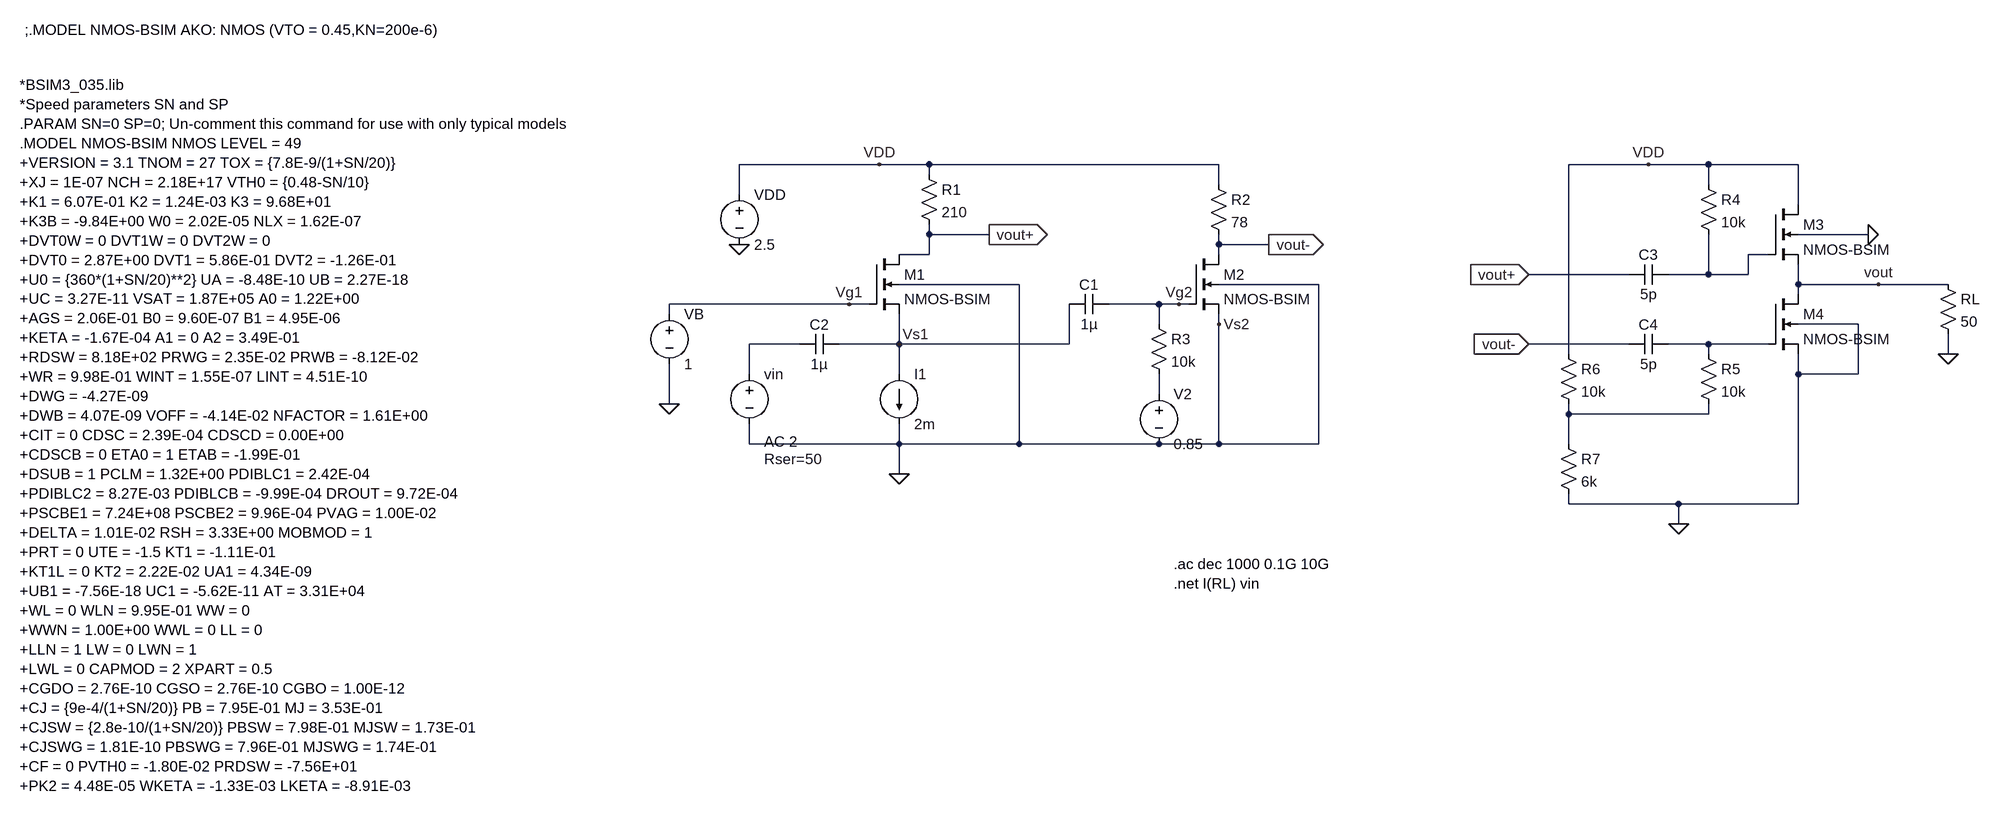
[diagram p0: schematic 3x350nm_nx.asc]
3x350nm_nx.asc, the LTspice schematic file:
Version 4
SHEET 1 2104 1272
WIRE 224 32 0 32
WIRE 304 32 224 32
WIRE 768 32 304 32
WIRE 1456 32 1328 32
WIRE 1552 32 1456 32
WIRE 1696 32 1552 32
WIRE 304 48 304 32
WIRE 768 64 768 32
WIRE 1552 64 1552 32
WIRE 0 80 0 32
WIRE 1696 96 1696 32
WIRE 304 144 304 128
WIRE 400 144 304 144
WIRE 1808 144 1696 144
WIRE 768 160 768 144
WIRE 848 160 768 160
WIRE 304 176 304 144
WIRE 304 176 256 176
WIRE 768 176 768 160
WIRE 1648 176 1616 176
WIRE 1424 208 1264 208
WIRE 1552 208 1552 144
WIRE 1552 208 1488 208
WIRE 1616 208 1616 176
WIRE 1616 208 1552 208
WIRE 448 224 256 224
WIRE 928 224 768 224
WIRE 1696 224 1696 192
WIRE 1824 224 1696 224
WIRE 1936 224 1824 224
WIRE 1696 240 1696 224
WIRE 176 256 -112 256
WIRE 208 256 176 256
WIRE 672 256 592 256
WIRE 704 256 672 256
WIRE 720 256 704 256
WIRE -112 272 -112 256
WIRE 672 288 672 256
WIRE 768 288 768 272
WIRE 1792 288 1696 288
WIRE 96 320 16 320
WIRE 256 320 256 272
WIRE 256 320 160 320
WIRE 528 320 528 256
WIRE 528 320 256 320
WIRE 1424 320 1264 320
WIRE 1552 320 1488 320
WIRE 1648 320 1552 320
WIRE 1328 336 1328 32
WIRE 1552 336 1552 320
WIRE 1936 336 1936 304
WIRE 16 368 16 320
WIRE 256 368 256 320
WIRE 1696 368 1696 336
WIRE 1792 368 1792 288
WIRE 1792 368 1696 368
WIRE 672 400 672 368
WIRE -112 416 -112 352
WIRE 1328 432 1328 416
WIRE 1552 432 1552 416
WIRE 1552 432 1328 432
WIRE 16 480 16 448
WIRE 256 480 256 448
WIRE 256 480 16 480
WIRE 448 480 448 224
WIRE 448 480 256 480
WIRE 672 480 448 480
WIRE 768 480 768 288
WIRE 768 480 672 480
WIRE 928 480 928 224
WIRE 928 480 768 480
WIRE 1328 480 1328 432
WIRE 256 528 256 480
WIRE 1328 576 1328 560
WIRE 1504 576 1328 576
WIRE 1696 576 1696 368
WIRE 1696 576 1504 576
WIRE 1504 608 1504 576
FLAG 0 160 0
FLAG 224 32 VDD
FLAG -112 416 0
FLAG 256 320 Vs1
FLAG 176 256 Vg1
FLAG 256 528 0
FLAG 400 144 vout+
IOPIN 400 144 Out
FLAG 848 160 vout-
IOPIN 848 160 Out
FLAG 704 256 Vg2
FLAG 768 288 Vs2
FLAG 1504 608 0
FLAG 1936 336 0
FLAG 1264 208 vout+
IOPIN 1264 208 In
FLAG 1264 320 vout-
IOPIN 1264 320 In
FLAG 1456 32 VDD
FLAG 1808 144 0
FLAG 1824 224 vout
SYMBOL voltage 0 64 R0
SYMATTR InstName VDD
SYMATTR Value 2.5
SYMBOL res 288 32 R0
SYMATTR InstName R1
SYMATTR Value 210
SYMBOL voltage -112 256 R0
WINDOW 123 0 0 Left 0
WINDOW 39 0 0 Left 0
SYMATTR InstName VB
SYMATTR Value 1
SYMBOL current 256 368 R0
WINDOW 123 0 0 Left 0
WINDOW 39 0 0 Left 0
SYMATTR InstName I1
SYMATTR Value 2m
SYMBOL nmos4 208 176 R0
SYMATTR InstName M1
SYMATTR Value NMOS-BSIM
SYMATTR Value2 l=1050n w=365u
SYMBOL voltage 16 352 R0
WINDOW 123 24 124 Left 2
WINDOW 39 24 152 Left 2
SYMATTR Value2 AC 2
SYMATTR SpiceLine Rser=50
SYMATTR InstName vin
SYMATTR Value ""
SYMBOL nmos4 720 176 R0
SYMATTR InstName M2
SYMATTR Value NMOS-BSIM
SYMATTR Value2 l=1050n w=1150u
SYMBOL res 752 48 R0
SYMATTR InstName R2
SYMATTR Value 78
SYMBOL cap 592 240 R90
WINDOW 0 0 32 VBottom 2
WINDOW 3 32 32 VTop 2
SYMATTR InstName C1
SYMATTR Value 1µ
SYMBOL res 656 272 R0
SYMATTR InstName R3
SYMATTR Value 10k
SYMBOL voltage 672 384 R0
WINDOW 123 0 0 Left 0
WINDOW 39 0 0 Left 0
SYMATTR InstName V2
SYMATTR Value 0.85
SYMBOL cap 160 304 R90
WINDOW 0 0 32 VBottom 2
WINDOW 3 32 32 VTop 2
SYMATTR InstName C2
SYMATTR Value 1µ
SYMBOL cap 1488 192 R90
WINDOW 0 0 32 VBottom 2
WINDOW 3 32 32 VTop 2
SYMATTR InstName C3
SYMATTR Value 5p
SYMBOL cap 1488 304 R90
WINDOW 0 0 32 VBottom 2
WINDOW 3 32 32 VTop 2
SYMATTR InstName C4
SYMATTR Value 5p
SYMBOL res 1536 48 R0
SYMATTR InstName R4
SYMATTR Value 10k
SYMBOL res 1536 320 R0
SYMATTR InstName R5
SYMATTR Value 10k
SYMBOL res 1312 320 R0
SYMATTR InstName R6
SYMATTR Value 10k
SYMBOL res 1312 464 R0
SYMATTR InstName R7
SYMATTR Value 6k
SYMBOL res 1920 208 R0
SYMATTR InstName RL
SYMATTR Value 50
SYMBOL nmos4 1648 96 R0
SYMATTR InstName M3
SYMATTR Value NMOS-BSIM
SYMATTR Value2 l=1050n w=120u
SYMBOL nmos4 1648 240 R0
SYMATTR InstName M4
SYMATTR Value NMOS-BSIM
SYMATTR Value2 l=1050n w=515u
TEXT -1152 -96 Left 2 !*BSIM3_035.lib\n*Speed parameters SN and SP\n.PARAM SN=0 SP=0; Un-comment this command for use with only typical models\n.MODEL NMOS-BSIM NMOS LEVEL = 49\n+VERSION = 3.1 TNOM = 27 TOX = {7.8E-9/(1+SN/20)}\n+XJ = 1E-07 NCH = 2.18E+17 VTH0 = {0.48-SN/10}\n+K1 = 6.07E-01 K2 = 1.24E-03 K3 = 9.68E+01\n+K3B = -9.84E+00 W0 = 2.02E-05 NLX = 1.62E-07\n+DVT0W = 0 DVT1W = 0 DVT2W = 0\n+DVT0 = 2.87E+00 DVT1 = 5.86E-01 DVT2 = -1.26E-01\n+U0 = {360*(1+SN/20)**2} UA = -8.48E-10 UB = 2.27E-18\n+UC = 3.27E-11 VSAT = 1.87E+05 A0 = 1.22E+00\n+AGS = 2.06E-01 B0 = 9.60E-07 B1 = 4.95E-06\n+KETA = -1.67E-04 A1 = 0 A2 = 3.49E-01\n+RDSW = 8.18E+02 PRWG = 2.35E-02 PRWB = -8.12E-02\n+WR = 9.98E-01 WINT = 1.55E-07 LINT = 4.51E-10\n+DWG = -4.27E-09\n+DWB = 4.07E-09 VOFF = -4.14E-02 NFACTOR = 1.61E+00\n+CIT = 0 CDSC = 2.39E-04 CDSCD = 0.00E+00\n+CDSCB = 0 ETA0 = 1 ETAB = -1.99E-01\n+DSUB = 1 PCLM = 1.32E+00 PDIBLC1 = 2.42E-04\n+PDIBLC2 = 8.27E-03 PDIBLCB = -9.99E-04 DROUT = 9.72E-04\n+PSCBE1 = 7.24E+08 PSCBE2 = 9.96E-04 PVAG = 1.00E-02\n+DELTA = 1.01E-02 RSH = 3.33E+00 MOBMOD = 1\n+PRT = 0 UTE = -1.5 KT1 = -1.11E-01\n+KT1L = 0 KT2 = 2.22E-02 UA1 = 4.34E-09\n+UB1 = -7.56E-18 UC1 = -5.62E-11 AT = 3.31E+04\n+WL = 0 WLN = 9.95E-01 WW = 0\n+WWN = 1.00E+00 WWL = 0 LL = 0\n+LLN = 1 LW = 0 LWN = 1\n+LWL = 0 CAPMOD = 2 XPART = 0.5\n+CGDO = 2.76E-10 CGSO = 2.76E-10 CGBO = 1.00E-12\n+CJ = {9e-4/(1+SN/20)} PB = 7.95E-01 MJ = 3.53E-01\n+CJSW = {2.8e-10/(1+SN/20)} PBSW = 7.98E-01 MJSW = 1.73E-01\n+CJSWG = 1.81E-10 PBSWG = 7.96E-01 MJSWG = 1.74E-01\n+CF = 0 PVTH0 = -1.80E-02 PRDSW = -7.56E+01\n+PK2 = 4.48E-05 WKETA = -1.33E-03 LKETA = -8.91E-03
TEXT -1144 -184 Left 2 !;.MODEL NMOS-BSIM AKO: NMOS (VTO = 0.45,KN=200e-6)
TEXT 696 672 Left 2 !.ac dec 1000 0.1G 10G\n.net I(RL) vin

The netlist it stands for:
* 3x350nm_nx.asc
VDD VDD 0 2.5
R1 VDD vout+ 210
VB Vg1 0 1
I1 Vs1 0 2m
M1 vout+ Vg1 Vs1 0 NMOS-BSIM l=1050n w=365u
vin N002 0 AC 2 Rser=50
M2 vout- Vg2 0 0 NMOS-BSIM l=1050n w=1150u
R2 VDD vout- 78
C1 Vg2 Vs1 1µ
R3 Vg2 N004 10k
V2 N004 0 0.85
C2 Vs1 N002 1µ
C3 N001 vout+ 5p
C4 N003 vout- 5p
R4 VDD N001 10k
R5 N003 N005 10k
R6 VDD N005 10k
R7 N005 0 6k
RL vout 0 50
M3 VDD N001 vout 0 NMOS-BSIM l=1050n w=120u
M4 vout N003 0 0 NMOS-BSIM l=1050n w=515u
.model NMOS NMOS
.model PMOS PMOS
.lib standard.mos
*BSIM3_035.lib
*Speed parameters SN and SP
.PARAM SN=0 SP=0; Un-comment this command for use with only typical models
.MODEL NMOS-BSIM NMOS LEVEL = 49
+VERSION = 3.1 TNOM = 27 TOX = {7.8E-9/(1+SN/20)}
+XJ = 1E-07 NCH = 2.18E+17 VTH0 = {0.48-SN/10}
+K1 = 6.07E-01 K2 = 1.24E-03 K3 = 9.68E+01
+K3B = -9.84E+00 W0 = 2.02E-05 NLX = 1.62E-07
+DVT0W = 0 DVT1W = 0 DVT2W = 0
+DVT0 = 2.87E+00 DVT1 = 5.86E-01 DVT2 = -1.26E-01
+U0 = {360*(1+SN/20)**2} UA = -8.48E-10 UB = 2.27E-18
+UC = 3.27E-11 VSAT = 1.87E+05 A0 = 1.22E+00
+AGS = 2.06E-01 B0 = 9.60E-07 B1 = 4.95E-06
+KETA = -1.67E-04 A1 = 0 A2 = 3.49E-01
+RDSW = 8.18E+02 PRWG = 2.35E-02 PRWB = -8.12E-02
+WR = 9.98E-01 WINT = 1.55E-07 LINT = 4.51E-10
+DWG = -4.27E-09
+DWB = 4.07E-09 VOFF = -4.14E-02 NFACTOR = 1.61E+00
+CIT = 0 CDSC = 2.39E-04 CDSCD = 0.00E+00
+CDSCB = 0 ETA0 = 1 ETAB = -1.99E-01
+DSUB = 1 PCLM = 1.32E+00 PDIBLC1 = 2.42E-04
+PDIBLC2 = 8.27E-03 PDIBLCB = -9.99E-04 DROUT = 9.72E-04
+PSCBE1 = 7.24E+08 PSCBE2 = 9.96E-04 PVAG = 1.00E-02
+DELTA = 1.01E-02 RSH = 3.33E+00 MOBMOD = 1
+PRT = 0 UTE = -1.5 KT1 = -1.11E-01
+KT1L = 0 KT2 = 2.22E-02 UA1 = 4.34E-09
+UB1 = -7.56E-18 UC1 = -5.62E-11 AT = 3.31E+04
+WL = 0 WLN = 9.95E-01 WW = 0
+WWN = 1.00E+00 WWL = 0 LL = 0
+LLN = 1 LW = 0 LWN = 1
+LWL = 0 CAPMOD = 2 XPART = 0.5
+CGDO = 2.76E-10 CGSO = 2.76E-10 CGBO = 1.00E-12
+CJ = {9e-4/(1+SN/20)} PB = 7.95E-01 MJ = 3.53E-01
+CJSW = {2.8e-10/(1+SN/20)} PBSW = 7.98E-01 MJSW = 1.73E-01
+CJSWG = 1.81E-10 PBSWG = 7.96E-01 MJSWG = 1.74E-01
+CF = 0 PVTH0 = -1.80E-02 PRDSW = -7.56E+01
+PK2 = 4.48E-05 WKETA = -1.33E-03 LKETA = -8.91E-03
;.MODEL NMOS-BSIM AKO: NMOS (VTO = 0.45,KN=200e-6)
.ac dec 1000 0.1G 10G
.net I(RL) vin
.backanno
.end